# Altium schematic sheet Sheet_1_2024-04-15.schdoc
size 521 x 249 mm; SheetNumber: 1; SheetTotal: 1
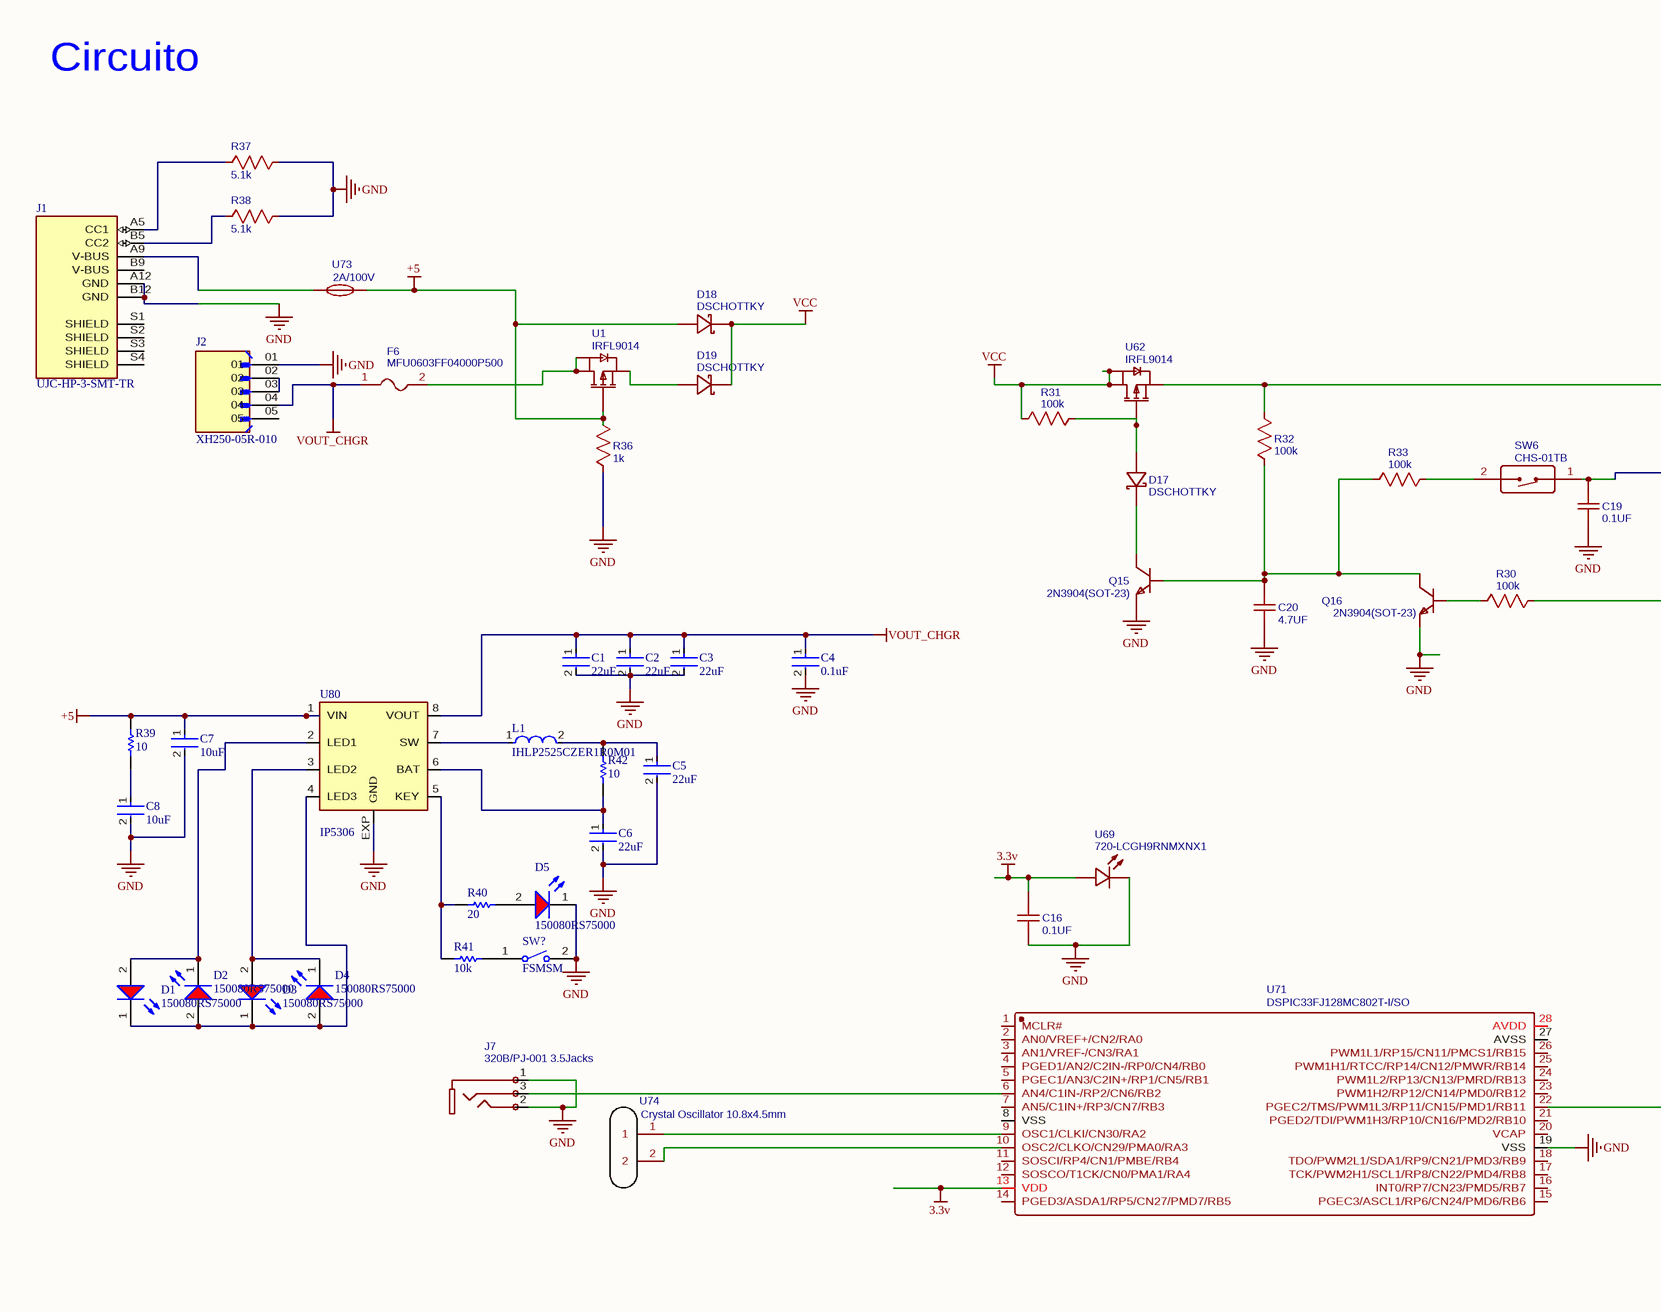
[diagram p0: Sheet_1_2024-04-15.schdoc, left]
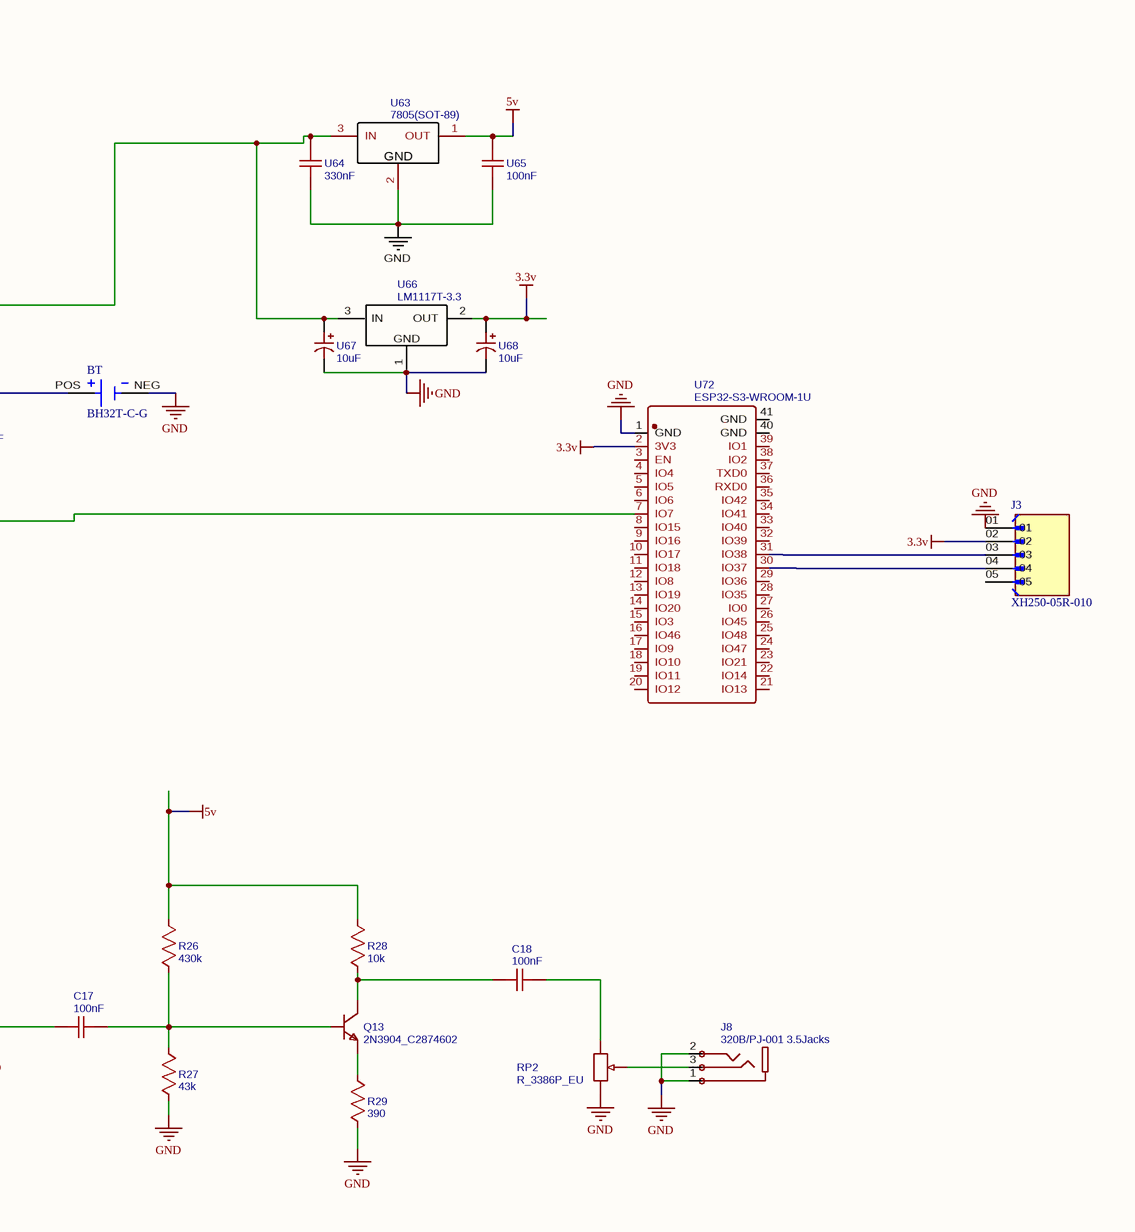
[diagram p1: Sheet_1_2024-04-15.schdoc, right]

## Parts
BT  BH32T-C-G  [BAT_BH32T-C-G]
C1  22uF  [FP-C0805C-DN-MFG]
C2  22uF  [FP-C0805C-DN-MFG]
C3  22uF  [FP-C0805C-DN-MFG]
C4  0.1uF  [FP-C0805C-DN-MFG]
C5  22uF  [FP-C0805C-DN-MFG]
C6  22uF  [FP-C0805C-DN-MFG]
C7  10uF  [FP-C0805C-DN-MFG]
C8  10uF  [FP-C0805C-DN-MFG]
C16  0.1UF  [RESC2012X60N]
C17  100nF  [RESC2012X60N]
C18  100nF  [RESC2012X60N]
C19  0.1UF  [RESC2012X60N]
C20  4.7UF  [RESC2012X60N]
D1  150080RS75000  [WL-SMCW_0805_150080xx75000]
D2  150080RS75000  [WL-SMCW_0805_150080xx75000]
D3  150080RS75000  [WL-SMCW_0805_150080xx75000]
D4  150080RS75000  [WL-SMCW_0805_150080xx75000]
D5  150080RS75000  [WL-SMCW_0805_150080xx75000]
D17  DSCHOTTKY  [SS34BF]
D18  DSCHOTTKY  [SS34BF]
D19  DSCHOTTKY  [SS34BF]
F6  MFU0603FF04000P500  [RESC2012X60N]
J1  UJC-HP-3-SMT-TR  [CUI_UJC-HP-3-SMT-TR]
J2  XH250-05R-010  [VALCON_XH250-05R-010]
J3  XH250-05R-010  [VALCON_XH250-05R-010 - duplicate]
J7  320B/PJ-001 3.5Jacks  [REAN_RJ3VM]
J8  320B/PJ-001 3.5Jacks  [REAN_RJ3VM]
L1  IHLP2525CZER1R0M01  [FP-IHLP-2525CZ-FP_2_413x3-MFG]
Q13  2N3904_C2874602  [TO92127P495H495-3]
Q15  2N3904(SOT-23)  [TO92127P495H495-3]
Q16  2N3904(SOT-23)  [TO92127P495H495-3]
R26  430k  [RESC2012X60N]
R27  43k  [RESC2012X60N]
R28  10k  [RESC2012X60N]
R29  390  [RESC2012X60N]
R30  100k  [RESC2012X60N]
R31  100k  [RESC2012X60N]
R32  100k  [RESC2012X60N]
R33  100k  [RESC2012X60N]
R36  1k  [RESC2012X60N]
R37  5.1k  [RESC2012X60N]
R38  5.1k  [RESC2012X60N]
R39  10  [RESC2013X50X30LL20T20]
R40  20  [RESC2013X50X30LL20T20]
R41  10k  [RESC2013X50X30LL20T20]
R42  10  [RESC2013X50X30LL20T20]
RP2  R_3386P_EU  [TRIM_3386P-1-101TLF]
SW6  CHS-01TB  [SW_TS09-63-25-R-260-SMT-TR]
SW?  FSMSM  [TECO-FSMSM-2_V]
U1  IRFL9014  [IRFL9014]
U62  IRFL9014  [IRFL9014]
U63  7805(SOT-89)  [TO254P1054X470X2600-3]
U64  330nF  [RESC2012X60N]
U65  100nF  [RESC2012X60N]
U66  LM1117T-3.3  [TO254P1054X470X1955-3]
U67  10uF  [CAP_EEEHB1H100P]
U68  10uF  [CAP_EEEHB1H100P]
U69  720-LCGH9RNMXNX1  [RESC2012X60N]
U71  DSPIC33FJ128MC802T-I/SO  [OST_ED281DT]
U72  ESP32-S3-WROOM-1U  [MODULE_ESP32-DEVKITC]
U73  2A/100V  [RESC2012X60N]
U74  Crystal Oscillator 10.8x4.5mm  [XTAL_ECS-400-20-46X]
U80  IP5306  [SOP8-P - duplicate]

## Nets
3.3v: C16.2 J3.02 U66.2(OUT) U68.1 U69.2(A) U71.13(VDD) U72.2(3V3)
5v: R26.2 R28.2 U63.1(OUT) U65.2
+5: C7.1 D18.2 R36.1 R39.2 U1.1(G) U73.2 U80.1(VIN)
GND: BT.NEG C1.2 C2.2 C3.2 C4.2 C5.2 C6.2 C7.2 C8.2 C16.1 C19.1 C20.1 D5.1(K) J1.A12(GND) J1.B12(GND) J2.01 J3.01 J7.1 J7.2 J8.1 J8.2 Q15.1(E) Q16.1(E) R27.1 R29.1 R36.2 R37.2 R38.2 RP2.3 SW?.2 U63.2(GND) U64.1 U65.1 U66.1(GND) U67.2 U68.2 U69.1(K) U71.19(VSS) U72.1(GND) U80.EXP(GND)
VCC: D18.1 D19.1 R31.2 U62.2(D) U62.4(D)
VOUT_CHGR: C1.1 C2.1 C3.1 C4.1 F6.1 J2.04 U80.8(VOUT)
NetBT_POS: BT.POS C19.2 SW6.1
NetC5_1: C5.1 L1.2 R42.2
NetC6_1: C6.1 R42.1 U80.6(BAT)
NetC8_1: C8.1 R39.1
NetC17_1: C17.1 U71.22(PGEC2/TMS/PWM1L3/RP11/CN15/PMD1/RB11)
NetC17_2: C17.2 Q13.2(B) R26.1 R27.2
NetC18_1: C18.1 Q13.3(C) R28.1
NetC18_2: C18.2 RP2.1
NetC20_2: C20.2 Q15.2(B) Q16.3(C) R32.2 R33.1
NetD1_1: D1.1(K) D2.2(A) D3.1(K) D4.2(A) U80.4(LED3)
NetD1_2: D1.2(A) D2.1(K) U80.2(LED1)
NetD3_2: D3.2(A) D4.1(K) U80.3(LED2)
NetD5_2: D5.2(A) R40.2
NetD17_1: D17.1 Q15.3(C)
NetD17_2: D17.2 R31.1 U62.1(G)
NetD19_2: D19.2 U1.3(S)
NetF6_2: F6.2 U1.2(D) U1.4(D)
NetJ1_A5: J1.A5(CC1) R37.1
NetJ1_A9: J1.A9(V-BUS) U73.1
NetJ1_B5: J1.B5(CC2) R38.1
NetJ2_02: J2.02 J2.03
NetJ3_03: J3.03 U72.31(IO38)
NetJ3_04: J3.04 U72.30(IO37)
NetJ7_3: J7.3 U71.6(AN4/C1IN-/RP2/CN6/RB2)
NetJ8_3: J8.3 RP2.2
NetL1_1: L1.1 U80.7(SW)
NetQ13_1: Q13.1(E) R29.2
NetQ16_2: Q16.2(B) R30.1
NetR30_2: R30.2 U72.7(IO7)
NetR32_1: R32.1 U62.3(S) U63.3(IN) U64.2 U66.3(IN) U67.1
NetR33_2: R33.2 SW6.2
NetR40_1: R40.1 R41.1 U80.5(KEY)
NetR41_2: R41.2 SW?.1
NetU71_9: U71.9(OSC1/CLKI/CN30/RA2) U74.1
NetU71_10: U71.10(OSC2/CLKO/CN29/PMA0/RA3) U74.2

Not connected (* = marked no-connect by the designer): J1 B9(V-BUS) S1(SHIELD) S2(SHIELD) S3(SHIELD) S4(SHIELD); J2 05; J3 05; U71 1(MCLR#) 2(AN0/VREF+/CN2/RA0) 3(AN1/VREF-/CN3/RA1) 4(PGED1/AN2/C2IN-/RP0/CN4/RB0) 5(PGEC1/AN3/C2IN+/RP1/CN5/RB1) 7(AN5/C1IN+/RP3/CN7/RB3) 8(VSS) 11(SOSCI/RP4/CN1/PMBE/RB4) 12(SOSCO/T1CK/CN0/PMA1/RA4) 14(PGED3/ASDA1/RP5/CN27/PMD7/RB5) 15(PGEC3/ASCL1/RP6/CN24/PMD6/RB6) 16(INT0/RP7/CN23/PMD5/RB7) 17(TCK/PWM2H1/SCL1/RP8/CN22/PMD4/RB8) 18(TDO/PWM2L1/SDA1/RP9/CN21/PMD3/RB9) 20(VCAP) 21(PGED2/TDI/PWM1H3/RP10/CN16/PMD2/RB10) 23(PWM1H2/RP12/CN14/PMD0/RB12) 24(PWM1L2/RP13/CN13/PMRD/RB13) 25(PWM1H1/RTCC/RP14/CN12/PMWR/RB14) 26(PWM1L1/RP15/CN11/PMCS1/RB15) 27(AVSS) 28(AVDD); U72 3(EN) 4(IO4) 5(IO5) 6(IO6) 8(IO15) 9(IO16) 10(IO17) 11(IO18) 12(IO8) 13(IO19) 14(IO20) 15(IO3) 16(IO46) 17(IO9) 18(IO10) 19(IO11) 20(IO12) 21(IO13) 22(IO14) 23(IO21) 24(IO47) 25(IO48) 26(IO45) 27(IO0) 28(IO35) 29(IO36) 32(IO39) 33(IO40) 34(IO41) 35(IO42) 36(RXD0) 37(TXD0) 38(IO2) 39(IO1) 40(GND) 41(GND)

## Notes on the sheet
- Circuito

## Library data of the parts
BT = BH32T-C-G: BATTERY HOLDER COIN 20MM PC PIN; MF: MPD; Value: *; Availability: Unavailable; SnapEDA_Link: https://www.snapeda.com/parts/BH32T-C-G/Memory%20Protection%20Devices/view-part/4219673/?ref=snap; Package: None; MP: BH32T-C-G; Price: None
C1-C8 = CMP-2007-00048-2: Capacitor; Ceramic; Cap; 22.0pF; Tol 5%; SMT; Vol-Rtg 50V; C0G; Tape and Reel; Manufacturer: KEMET; Manufacturer Part Number: C0805C220J5GACTU; Temperature Coefficient: 30ppm/°C; Capacitance: 22 pF; Value: 22 pF; Description: C0805 22 pF C0G 30ppm/°C 5.00% 50 V; Tolerance: 0.05; Device Class L1: Passive Components; Mouser Description: Multilayer Ceramic Capacitors MLCC - SMD/SMT 50volts 22pF C0G 5%; Temperature Range Low: -55°C; Automotive: No; Voltage Rating: 50 V; Material: Ceramic; Category: Cap; Height: 0.88mm; Temperature Range High: +125°C; Digikey Description: Capacitor; Ceramic; Cap; 22.0pF; Tol 5%; SMT; Vol-Rtg 50V; C0G; Tape and Reel; Octopart: https://octopart.com/c0805c220j5gactu-kemet-145470; ComponentLink2Description: Datasheet; Device Class L2: Capacitors; Ipc Land Pattern Name: CAPC200125X78; RoHS: TRUE; ComponentLink2URL: https://content.kemet.com/datasheets/KEM_C1003_C0G_SMD.pdf; Temperature: -55°C to +125°C; Device Class L3: Ceramic Capacitors; Lead Free: Yes; Temperature Characteristic: C0G; Package: C0805C-DN
C16 C19 = 0.1UF: Manufacturer: ReliaPro; Manufacturer Part: 250V 0.1UF 5% CBBCapacitor; nameAlias: Value; Supplier: LCSC; Supplier Part: C46804; JLCPCB Part Class: Extended Part; spicePre: C; spiceSymbolName: 250V 0.1UF 5% CBBCapacitor
C17 C18 = 100nF: nameAlias: Value(F); Contributor: LCEDA_Lib; spicePre: C; spiceSymbolName: C_0603_US
C20 = 4.7UF: Manufacturer: ReliaPro; Manufacturer Part: 250V 0.1UF 5% CBBCapacitor; nameAlias: Value; Supplier: LCSC; Supplier Part: C46804; JLCPCB Part Class: Extended Part; spicePre: C; spiceSymbolName: 250V 0.1UF 5% CBBCapacitor
D1-D5 = CMP-1426-00011-2: NexarPartId: 29717781; Peak Wavelength: 630nm; Wavelength: 625nm; Viewing Angle: 140°; Test Current: 20mA; Forward Voltage: 2V; Forward Current: 100mA; Lens Style: Clear, Rectangular; Color: Red; Luminous Intensity: 150mcd; Max Reverse Voltage (DC): 5V; Length: 2mm; Case Code (Imperial): 0805; RoHS: Compliant; Max Operating Temperature: 85°C; Height: 700µm; Packaging: Tape and Reel; Case/Package: 0805; REACH SVHC: Unknown; Dominant Wavelength: 625nm; Min Operating Temperature: -40°C; Case Code (Metric): 2012; Mount: Surface Mount; Width: 1.25mm
D17-D19 = DSCHOTTKY: Manufacturer: null; Contributor: LCSC; Supplier: LCSC; Supplier Part: C9900012836; Manufacturer Part: DSchottky; JLCPCB Part Class: Extended Part; spicePre: D; spiceSymbolName: DSCHOTTKY
F6 = MFU0603FF04000P500: Manufacturer: VISHAY(威世); Contributor: LCSC; Supplier: LCSC; Supplier Part: C1972776; Manufacturer Part: MFU0603FF04000P500; JLCPCB Part Class: Extended Part; spicePre: F; spiceSymbolName: MFU0603FF04000P500
J1 = UJC-HP-3-SMT-TR: Type C, 3 A, Right Angle, Surface Mount (SMT), Power-Only USB Receptacle; Value: *; Availability: Unavailable; Price: None; Package: None; MP: UJC-HP-3-SMT-TR
J2 J3 = XH250-05R-010: Valcon Wire-to-Board 2.50mm Straight & Right Angle PCB Connectors; SnapEDA_Link: https://www.snapeda.com/parts/XH250-05R-010/Valcon/view-part/?ref=snap; Package: None; Value: *; MF: Valcon; MP: XH250-05R-010; Check_prices: https://www.snapeda.com/parts/XH250-05R-010/Valcon/view-part/?ref=eda
J7 J8 = 320B/PJ-001 3.5Jacks: Manufacturer: ReliaPro; Supplier Part: C3792; Supplier: LCSC; Manufacturer Part: 320B/PJ-001 3.5Jacks; spicePre: J; spiceSymbolName: 320B/PJ-001 3.5Jacks
L1 = CMP-02424-000599-1: Commercial Inductors, High Saturation Series 1uH 11A 10mΩ 20%; Self Resonant Frequency: 5MHz; Test Frequency: 100kHz; Shielding: Shielded; Core Material: Metal; Saturation Current: 22A; DC Resistance (DCR): 10mR; Current Rating: 11A; Packaging: Tape and Reel; Width: 6.47mm; Number of Pins: 2; Case/Package: 2525; Termination: SMD/SMT; Length: 7.24mm; Height: 3mm; Min Operating Temperature: -55°C; Mount: Surface Mount; Inductance Tolerance: 20%; Max Operating Temperature: 125°C; Military Standard: Not; Max DC Current: 11A; RMS Current (Irms): 11A; Lead Free: Lead Free; Depth: 6.72mm; Tolerance: 20%; Package Quantity: 2000; Radiation Hardening: No; Contact Plating: Tin; Inductance: 1uH
Q13 = 2N3904_C2874602: Manufacturer: JSMSEMI(杰盛微); Manufacturer Part: 2N3904; Contributor: LCSC; Supplier: LCSC; Supplier Part: C2874602; JLCPCB Part Class: Extended Part; spicePre: Q; spiceSymbolName: 2N3904_C2874602
Q15 Q16 = 2N3904(SOT-23): Manufacturer: KEC; Manufacturer Part: 2n3904S-RTK/PS; Contributor: LCEDA_Lib; Supplier: LCSC; Supplier Part: C18536; Paste Type: SOT-23; spicePre: Q; spiceSymbolName: 2N3904(SOT-23)
R26 = 430k: nameAlias: Value(Ω); Contributor: LCEDA_Lib; spicePre: R; spiceSymbolName: R_0603_US
R27 = 43k: nameAlias: Value(Ω); Contributor: LCEDA_Lib; spicePre: R; spiceSymbolName: R_0603_US
R28 = 10k: nameAlias: Value(Ω); Contributor: LCEDA_Lib; spicePre: R; spiceSymbolName: R_0603_US
R29 = 390: nameAlias: Value(Ω); Contributor: LCEDA_Lib; spicePre: R; spiceSymbolName: R_0603_US
R30-R33 = 100k: nameAlias: Value(Ω); Contributor: LCEDA_Lib; spicePre: R; spiceSymbolName: R_0603_US
R36-R38 = 1k: nameAlias: Value(Ω); Contributor: LCEDA_Lib; spicePre: R; spiceSymbolName: R_0603_US
R39-R42 = CMP-2001-04896-1: Manufacturer: Vishay Dale; Part Number: CRCW08050000Z0EA
RP2 = R_3386P_EU: nameAlias: Resistance (Ohms); Contributor: LCEDA_Lib; Value(Ω): 100K; Package Display: No; Supplier: LCSC; spicePre: R; spiceSymbolName: R_3386P_EU
SW6 = CHS-01TB: Manufacturer: NIDEC(尼得科); Contributor: LCSC; Supplier: LCSC; Supplier Part: C2680613; Manufacturer Part: CHS-01TB; JLCPCB Part Class: Extended Part; spicePre: S; spiceSymbolName: CHS-01TB
SW? = CMP-2000-07511-1: FSMSM Push Button Switch, 50 mA, -35 to 85 degC, 2-Pin SMD, RoHS, Bulk; Manufacturer: TE Connectivity; Actuator Length: 1.07mm; Electrical Life: 20000Cycles; Actuator Material: Polyamide; Current Rating: 50mA; Illumination Type: Illuminated; Voltage Rating (DC): 24V; Contact Resistance: 100mOhm; Case\/Package: SMD/SMT; Operating Force: 180gf; Switch Travel: 0.25mm; Max Voltage Rating (DC): 12V; Throw Configuration: SPST; Packaging: LoosePiece; Max Operating Temperature: 85degC; ELV: Compliant; Package Description: 2-Pin Surface Mount Device, Body 6 x 3.5 mm, Pitch 9.19 mm; RoHSCompliant: true; Manufacturer URL: http://www.te.com/; Contact Plating: Silver; Contact Material: Brass; Mounting Technology: SurfaceMount; Contact Current Rating: 50mA; Datasheet Version: Rev. C2, 08/2014; Datasheet URL: http://www.te.com/commerce/DocumentDelivery/DDEController?Action=showdoc&DocId=Customer+Drawing%7F1437566-3%7FC2%7Fpdf%7FEnglish%7FENG_CD_1437566-3_C2_1437566_3_1_c.dwg.pdf%7F1437566-3; Mechanical Life: 20000Cycles; Package Reference: FSMSM; REACH SVHC: Unknown; Orientation: Straight; Min Operating Temperature: -35degC; Lead Free: LeadFree; Termination: GullWing; Package Quantity: 1000; Mount: SurfaceMount
U1 U62 = IRFL9014: Manufacturer: TECH PUBLIC(台舟); Contributor: lcsc; Supplier: LCSC; Supplier Part: C5246418; Manufacturer Part: IRFL9014; spicePre: U; spiceSymbolName: IRFL9014
U63 = 7805(SOT-89): Manufacturer: CJ; Manufacturer Part: CJ78L05; Paste Type: expand; Contributor: LCEDA_Lib; Supplier: LCSC; image: //image.lceda.cn/szlcsc/C2079.jpg; Supplier Part: C2079; spicePre: U; spiceSymbolName: 7805(SOT-89)
U64 = 330nF: Manufacturer: TDK; Manufacturer Part: B32560J3334K000; Contributor: lcsc; nameAlias: Value; Supplier: LCSC; Supplier Part: C3768307; spicePre: U; spiceSymbolName: B32560J3334K000
U65 = 100nF: Manufacturer: TDK; Manufacturer Part: B32560J3334K000; Contributor: lcsc; nameAlias: Value; Supplier: LCSC; Supplier Part: C3768307; spicePre: U; spiceSymbolName: B32560J3334K000
U66 = LM1117T-3.3: Manufacturer: HGSEMI(华冠); Contributor: LCSC; Supplier: LCSC; Supplier Part: C498321; Manufacturer Part: LM1117T-3.3; JLCPCB Part Class: Extended Part; spicePre: U; spiceSymbolName: LM1117T-3.3
U67 U68 = 10uF: Manufacturer: Kyocera AVX; Manufacturer Part: F980J106MMA; Contributor: lcsc; nameAlias: Value; Supplier: LCSC; Supplier Part: C4153836; spicePre: U; spiceSymbolName: F980J106MMA
U69 = 720-LCGH9RNMXNX1: Manufacturer: null; Contributor: lcsc; Supplier: LCSC; Supplier Part: C9900019959; Manufacturer Part: 720-LCGH9RNMXNX1; JLCPCB Part Class: Extended Part; spicePre: U; spiceSymbolName: 720-LCGH9RNMXNX1
U71 = DSPIC33FJ128MC802T-I/SO: Manufacturer: MICROCHIP(美国微芯); Contributor: lcsc; Supplier: LCSC; Supplier Part: C629364; Manufacturer Part: dsPIC33FJ128MC802T-I/SO; JLCPCB Part Class: Extended Part; spicePre: U; spiceSymbolName: DSPIC33FJ128MC802T-I/SO
U72 = ESP32-S3-WROOM-1U: Manufacturer: null; Contributor: lcsc; Supplier: LCSC; Supplier Part: C9900027631; Manufacturer Part: ESP32-S3-WROOM-1U; JLCPCB Part Class: Extended Part; spicePre: U; spiceSymbolName: ESP32-S3-WROOM-1U
U73 = 2A/100V: Manufacturer: null; Manufacturer Part: 20A/100V; Contributor: lcsc; Supplier: LCSC; Supplier Part: C9900024395; JLCPCB Part Class: Extended Part; spicePre: U; spiceSymbolName: 20A/100V
U74 = Crystal Oscillator 10.8x4.5mm: Contributor: colebenedicto; spicePre: U; spiceSymbolName: Crystal Oscillator 10.8x4.5mm
U80 = IP5306: RC (Pi) EMI Filter 2nd Order Low Pass 2 Channel R = 2.2kOhms, C = 1700pF 8-UFBGA, WLCSP; MF: NXP USA Inc.; Check_prices: https://www.snapeda.com/parts/IP5306/NXP+Semiconductors/view-part/?ref=eda; Availability: Not in stock; Price: None; Package: UFBGA-8 NXP Semiconductors; Value: *; SnapEDA_Link: https://www.snapeda.com/parts/IP5306/NXP+Semiconductors/view-part/?ref=snap; MP: IP5306